# EAGLE schematic blinder (EAGLE 6.2)
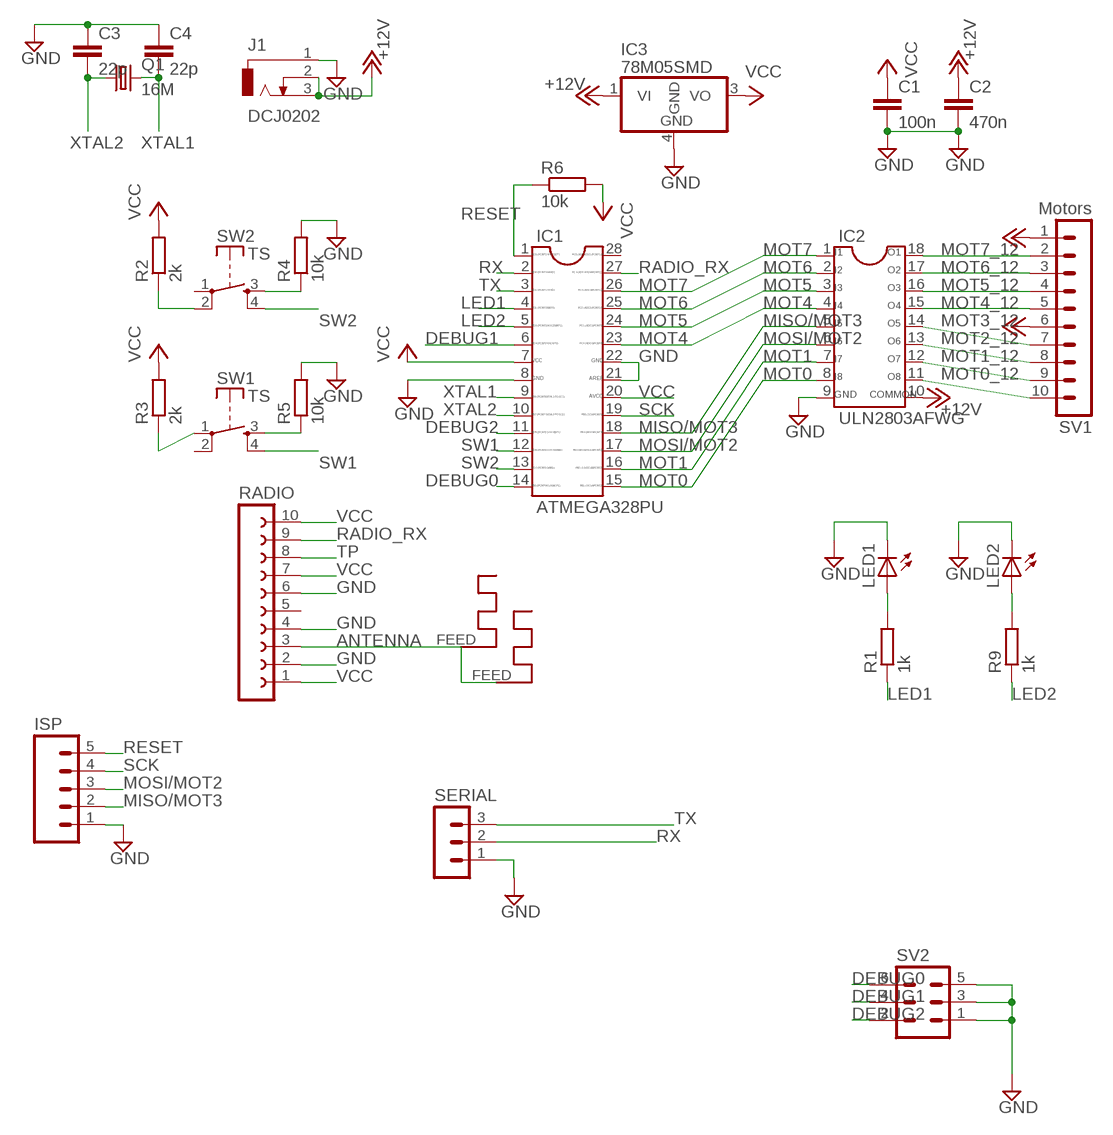
[diagram p0: schematic, sheet 1]

## Parts
C1  100n  C-EUC0805  [C0805]
C2  470n  C-EUC0805  [C0805]
C3  22p  C-EUC0805  [C0805]
C4  22p  C-EUC0805  [C0805]
IC1  ATMEGA328PU  ATMEGA328P-3  [DIL28-3]
IC2  ULN2803AFWG  [DIL18]
IC3  78M05SMD  [DPACK]
ISP  M05LOCK  [1X05_LOCK]
J1  DCJ0202  [DCJ0202]
LED1  LED3MM  [LED3MM]
LED2  LED3MM  [LED3MM]
Q1  16M  CRYSTALHC18U-V  [HC18U-V]
R1  1k  R-EU_R0805  [R0805]
R2  2k  R-EU_R0805  [R0805]
R3  2k  R-EU_R0805  [R0805]
R4  10k  R-EU_R0805  [R0805]
R5  10k  R-EU_R0805  [R0805]
R6  10k  R-EU_R0805  [R0805]
R9  1k  R-EU_R0805  [R0805]
RADIO  FE10W  [FE10W]
SERIAL  MA03-1  [MA03-1]
SV1  Motors  MA10-1W  [MA10-1W]
SV2  MA03-2  [MA03-2]
SW1  TS  [TS]
SW2  TS  [TS]
U$1  ANT44350H  [DIPOLEHALF443.95_50]
U$2  ANT44350H  [DIPOLEHALF443.95_50]

## Nets
+12V: C2.1 IC2.10(COMMON) IC3.1(VI) J1.2 J1.3 SV1.1 SV1.6
ANTENNA: RADIO.3 U$1.FEED U$2.FEED
DEBUG0: IC1.14(PB0) SV2.6
DEBUG1: IC1.6(PD4) SV2.4
DEBUG2: IC1.11(PD5) SV2.2
GND: C1.2 C2.2 C3.1 C4.1 IC1.8(GND) IC1.21(AREF) IC1.22(GND2) IC2.9(GND) IC3.4(GND) ISP.1 J1.1 LED1.K(C) LED2.K(C) R4.2 R5.2 RADIO.2 RADIO.4 RADIO.6 SERIAL.1 SV2.1 SV2.3 SV2.5
LED1: IC1.4(PD2) R1.1
LED2: IC1.5(PD3) R9.1
MISO/MOT3: IC1.18(PB4) IC2.5(I5) ISP.2
MOSI/MOT2: IC1.17(PB3) IC2.6(I6) ISP.3
MOT0: IC1.15(PB1) IC2.8(I8)
MOT0_12: IC2.11(O8) SV1.10
MOT1: IC1.16(PB2) IC2.7(I7)
MOT1_12: IC2.12(O7) SV1.9
MOT2_12: IC2.13(O6) SV1.8
MOT3_12: IC2.14(O5) SV1.7
MOT4: IC1.23(PC0) IC2.4(I4)
MOT4_12: IC2.15(O4) SV1.5
MOT5: IC1.24(PC1) IC2.3(I3)
MOT5_12: IC2.16(O3) SV1.4
MOT6: IC1.25(PC2) IC2.2(I2)
MOT6_12: IC2.17(O2) SV1.3
MOT7: IC1.26(PC3) IC2.1(I1)
MOT7_12: IC2.18(O1) SV1.2
N$1: LED1.A R1.2
N$2: LED2.A R9.2
N$7: R5.1 SW1.3(S)
N$8: R4.1 SW2.3(S)
N$9: R3.1 SW1.1(P)
N$10: R2.1 SW2.2(P)
RADIO_RX: IC1.27(PC4) RADIO.9
RESET: IC1.1(PC6) ISP.5 R6.1
RX: IC1.2(PD0) SERIAL.2
SCK: IC1.19(PB5) ISP.4
SW1: IC1.12(PD6) SW1.4(S)
SW2: IC1.13(PD7) SW2.4(S)
TP: RADIO.8
TX: IC1.3(PD1) SERIAL.3
VCC: C1.1 IC1.7(VCC) IC1.20(AVCC) IC3.3(VO) R2.2 R3.2 R6.2 RADIO.1 RADIO.7 RADIO.10
XTAL1: C4.2 IC1.9(PB6) Q1.2
XTAL2: C3.2 IC1.10(PB7) Q1.1
Unconnected: IC1.28(PC5) RADIO.5 SW1.2(P) SW2.1(P)

## Library data of the parts
C1-C4 = resistor:C-EU: CAPACITOR, European symbol
IC1 = flux:ATMEGA328P: Dual In Line
IC2 = flux:ULN2803AFWG: Dual In Line / Socket
IC3 = flux:78M05
ISP = SparkFun:M05: Header 5 Standard 5-pin 0.1" header. Use with straight break away headers (SKU : PRT-00116), right angle break away headers (PRT-00553), swiss pins (PRT-00743), machine pins (PRT-00117), and female headers (PRT-00115). Molex polarized connector foot print use with SKU : PRT-08230 with associated crimp pins and housings.
J1 = con-jack:DCJ0202: DC POWER JACK Source: DCJ0202.pdf; OC_FARNELL: unknown; OC_NEWARK: unknown
LED1 LED2 = led:LED: LED OSRAM: - CHIPLED LG R971, LG N971, LY N971, LG Q971, LY Q971, LO R971, LY R971 LH N974, LH R974 LS Q976, LO Q976, LY Q976 LO Q996 - Hyper CHIPLED LW Q18S LB Q993, LB Q99A, LB R99A - SideLED LS A670, LO A670, LY A670, LG A670, LP A670 LB A673, LV A673, LT A673, LW A673 LH A674 LY A675 LS A676, LA A676, LO A676, LY A676, LW A676 LS A679, LY A679, LG A679 - Hyper Micro SIDELED® LS Y876, LA Y876, LO Y876, LY Y876 LT Y87S - SmartLED LW L88C, LW L88S LB L89C, LB L89S, LG L890 LS L89K, LO L89K, LY L89K LS L896, LA L896, LO L896, LY L896 - TOPLED LS T670, LO T670, LY T670, LG T670, LP T670 LSG T670, LSP T670, LSY T670, LOP T670, LYG T670 LG T671, LOG T671, LSG T671 LB T673, LV T673, LT T673, LW T673 LH T674 LS T676, LA T676, LO T676, LY T676, LB T676, LH T676, LSB T676, LW T676 LB T67C, LV T67C, LT T67C, LS T67K, LO T67K, LY T67K, LW E67C LS E67B, LA E67B, LO E67B, LY E67B, LB E67C, LV E67C, LT E67C LW T67C LS T679, LY T679, LG T679 LS T770, LO T770, LY T770, LG T770, LP T770 LB T773, LV T773, LT T773, LW T773 LH T774 LS E675, LA E675, LY E675, LS T675 LS T776, LA T776, LO T776, LY T776, LB T776 LHGB T686 LT T68C, LB T68C - Hyper Mini TOPLED® LB M676 - Mini TOPLED Santana® LG M470 LS M47K, LO M47K, LY M47K Source: http://www.osram.convergy.de LUXEON: - LUMILED® LXK2-PW12-R00, LXK2-PW12-S00, LXK2-PW14-U00, LXK2-PW14-V00 LXK2-PM12-R00, LXK2-PM12-S00, LXK2-PM14-U00 LXK2-PE12-Q00, LXK2-PE12-R00, LXK2-PE12-S00, LXK2-PE14-T00, LXK2-PE14-U00 LXK2-PB12-K00, LXK2-PB12-L00, LXK2-PB12-M00, LXK2-PB14-N00, LXK2-PB14-P00, LXK2-PB14-Q00 LXK2-PR12-L00, LXK2-PR12-M00, LXK2-PR14-Q00, LXK2-PR14-R00 LXK2-PD12-Q00, LXK2-PD12-R00, LXK2-PD12-S00 LXK2-PH12-R00, LXK2-PH12-S00 LXK2-PL12-P00, LXK2-PL12-Q00, LXK2-PL12-R00 Source: www.luxeon.com KINGBRIGHT: KA-3528ASYC Source: www.kingbright.com
Q1 = crystal:CRYSTAL: CRYSTAL; OC_FARNELL: unknown; OC_NEWARK: unknown
R1-R6 R9 = resistor:R-EU_: RESISTOR, European symbol
RADIO = con-lsta:FE10W: FEMALE HEADER; OC_FARNELL: unknown; OC_NEWARK: unknown
SERIAL = con-lstb:MA03-1: PIN HEADER; OC_FARNELL: unknown; OC_NEWARK: unknown
SV1 = con-lstb:MA10-1W: PIN HEADER; OC_FARNELL: unknown; OC_NEWARK: unknown
SV2 = con-lstb:MA03-2: PIN HEADER; OC_FARNELL: unknown; OC_NEWARK: unknown
SW1 SW2 = flux:TS
U$1 U$2 = flux:ANT443